# Altium project LiBattery-ChargeAndDischarge.PrjPcb
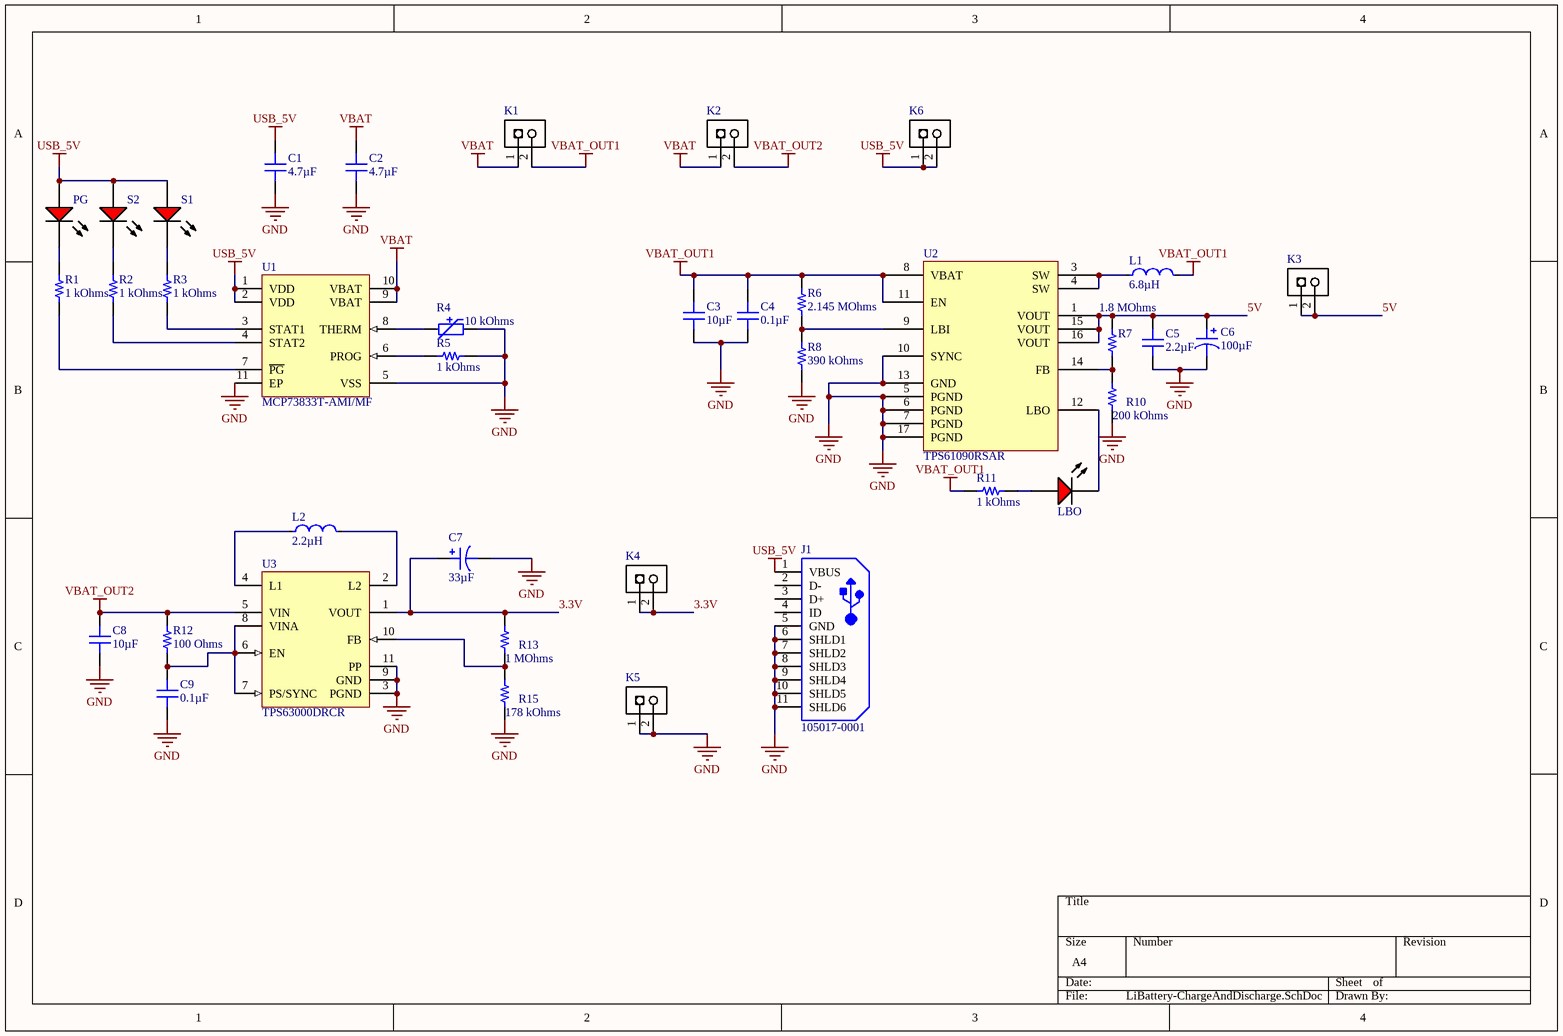
[diagram p0: LiBattery-ChargeAndDischarge.SchDoc]
1 sheet, 38 parts. Net scope: global (net labels, ports and power ports of the same name join across sheets).
Board file: LiBattery-ChargeAndDischarge.PcbDoc

## Sheet LiBattery-ChargeAndDischarge.SchDoc
size A4; SheetNumber: 1; SheetTotal: 1

### Parts
C1  4.7µF  [CAP 0603_1608]
C2  4.7µF  [CAP 0603_1608]
C3  10µF  [CAP 0603_1608]
C4  0.1µF  [CAP 0603_1608]
C5  2.2µF  [CAP 0603_1608]
C6  100µF  [CAP POL 1411_3528]
C7  33µF  [CAP POL 1411_3528]
C8  10µF  [CAP 0603_1608]
C9  0.1µF  [CAP 0603_1608]
J1  105017-0001  [USB-MICRO-B_V]
K1  HEADER-1X2  [HEADER-1X2]  (value not drawn)
K2  HEADER-1X2  [HEADER-1X2]  (value not drawn)
K3  HEADER-1X2  [HEADER-1X2]  (value not drawn)
K4  HEADER-1X2  [HEADER-1X2]  (value not drawn)
K5  HEADER-1X2  [HEADER-1X2]  (value not drawn)
K6  HEADER-1X2  [HEADER-1X2]  (value not drawn)
L1  6.8µH  [FP-IHLP-2525CZ-FP_2_413x3-MFG]
L2  2.2µH  [FP-IHLP-2525CZ-FP_2_413x3-MFG]
LBO  TLMS1100-GS08  [VISH-TLMX1100_V]  (value not drawn)
PG  TLMS1100-GS08  [VISH-TLMX1100_V]  (value not drawn)
R1  1 kOhms  [RES 0603_1608]
R2  1 kOhms  [RES 0603_1608]
R3  1 kOhms  [RES 0603_1608]
R4  10 kOhms  [PTC 0603_1608]
R5  1 kOhms  [RES 0603_1608]
R6  2.145 MOhms  [RES 0603_1608]
R7  1.8 MOhms  [RES 0603_1608]
R8  390 kOhms  [RES 0603_1608]
R10  200 kOhms  [RES 0603_1608]
R11  1 kOhms  [RES 0603_1608]
R12  100 Ohms  [RES 0603_1608]
R13  1 MOhms  [RES 0603_1608]
R15  178 kOhms  [RES 0603_1608]
S1  TLMS1100-GS08  [VISH-TLMX1100_V]  (value not drawn)
S2  TLMS1100-GS08  [VISH-TLMX1100_V]  (value not drawn)
U1  MCP73833T-AMI/MF  [DFN-MF10]
U2  TPS61090RSAR  [TI VQFN-16 4X4MM RSA]
U3  TPS63000DRCR  [DRC0010J_V]

### Nets
GND: C1.1 C2.1 C3.1 C4.2 C5.1 C6.2 C7.2 C8.1 C9.2 J1.5(GND) J1.6(SHLD1) J1.7(SHLD2) J1.8(SHLD3) J1.9(SHLD4) J1.10(SHLD5) J1.11(SHLD6) K5.1 K5.2 R4.1 R5.1 R8.1 R10.2 R15.2 U1.5(VSS) U1.11(EP) U2.5(PGND) U2.6(PGND) U2.7(PGND) U2.10(SYNC) U2.13(GND) U2.17(PGND) U3.3(PGND) U3.9(GND) U3.11(PP)
USB_5V: C1.2 J1.1(VBUS) K6.1 K6.2 PG.1(A) S1.1(A) S2.1(A) U1.1(VDD) U1.2(VDD)
VBAT: C2.2 K1.1 K2.1 U1.9(VBAT) U1.10(VBAT)
VBAT_OUT1: C3.2 C4.1 K1.2 L1.2 R6.2 R11.2 U2.8(VBAT) U2.11(EN)
VBAT_OUT2: C8.2 K2.2 R12.1 U3.5(VIN)
3.3V: C7.1 K4.1 K4.2 R13.1 U3.1(VOUT)
5V: C5.2 C6.1 K3.1 K3.2 R7.1 U2.1(VOUT) U2.15(VOUT) U2.16(VOUT)
NetC9_1: C9.1 R12.2 U3.6(EN) U3.7(PS/SYNC) U3.8(VINA)
NetL1_1: L1.1 U2.3(SW) U2.4(SW)
NetL2_1: L2.1 U3.4(L1)
NetL2_2: L2.2 U3.2(L2)
NetLBO_1: LBO.1(A) R11.1
NetLBO_2: LBO.2(K) U2.12(LBO)
NetPG_2: PG.2(K) R1.2
NetR1_1: R1.1 U1.7(~{PG})
NetR2_1: R2.1 U1.4(STAT2)
NetR2_2: R2.2 S2.2(K)
NetR3_1: R3.1 U1.3(STAT1)
NetR3_2: R3.2 S1.2(K)
NetR4_2: R4.2 U1.8(THERM)
NetR5_2: R5.2 U1.6(PROG)
NetR6_1: R6.1 R8.2 U2.9(LBI)
NetR7_2: R7.2 R10.1 U2.14(FB)
NetR13_2: R13.2 R15.1 U3.10(FB)

Not connected (* = marked no-connect by the designer): J1 2(D-) 3(D+) 4(ID)

### Library data of the parts
C1 C2 = C0603C105K4RACAUTO: CAP CER 0603 1UF 16V X7R 10%; Manufacturer: KEMET; Capacitance: 1µF; Part Number: C0603C105K4RACAUTO; Value: 4.7µF; Applications: Automotive, Bypass, Decoupling; ComponentLink1Description: Datasheet; ComponentLink1URL: https://api.kemet.com/component-edge/download/datasheet/C0603C105K4RACAUTO.pdf; ComponentLink2Description: DigiKey Link; ComponentLink2URL: http://digikey.com/product-detail/en/kemet/C0603C105K4RACAUTO/399-17704-1-ND/8635855; Device Package: 0603 (1608 Metric); LastUpdated: 2020/9/2 1:03:36; Lifecycle Status: Active; Minimum Order: 1; Mounting Type: Surface Mount, MLCC; Operating Temperature: -55°C ~ 125°C; Package / Case: 0603 (1608 Metric); Packaging: TapeAndReel; PartId: 2179; Part Status: Active; Price: 0.02; Ratings: AEC-Q200; Series: SMD Auto X7R; Size / Dimension: 0.063" L x 0.031" W (1.60mm x 0.80mm); Supplier 1: DigiKey; Supplier Part Number 1: 399-17704-1-ND; Temperature Coefficient: X7R; Thickness (Max): 0.037" (0.95mm); Tolerance: ±10%; Voltage - Rated: 16V
C3 C8 = GRM188R60J106ME47D: CAP CER 10UF 6.3V X5R 0603; Manufacturer: Murata Electronics; Tolerance: ±20%; Part Number: GRM188R60J106ME47D; Value: 10µF; Applications: General Purpose; Capacitance: 10µF; ComponentLink1Description: Datasheet; ComponentLink1URL: https://www.murata.com/~/media/webrenewal/support/library/catalog/products/capacitor/mlcc/c02e.ashx?la=en-us; ComponentLink2Description: DigiKey Link; ComponentLink2URL: http://digikey.com/product-detail/en/murata-electronics/GRM188R60J106ME47D/490-3896-1-ND/965938; Device Package: 0603 (1608 Metric); LastUpdated: 2020/9/2 1:03:35; Lifecycle Status: Active; Minimum Order: 1; Mounting Type: Surface Mount, MLCC; Operating Temperature: -55°C ~ 85°C; Package / Case: 0603 (1608 Metric); Packaging: TapeAndReel; PartId: 2351; Part Status: Active; Price: 0.03; Series: GRM; Size / Dimension: 0.063" L x 0.031" W (1.60mm x 0.80mm); Supplier 1: DigiKey; Supplier Part Number 1: 490-3896-1-ND; Temperature Coefficient: X5R; Thickness (Max): 0.035" (0.90mm); Voltage - Rated: 6.3V
C4 = 100X14W104MV4T: CAP CER 0.1UF 10V X7R 0603; Manufacturer: Johanson Dielectrics Inc.; Tolerance: ±20%; Part Number: 100X14W104MV4T; Value: 0.1µF; Applications: Bypass, Decoupling; Capacitance: 0.1µF; ComponentLink1Description: Datasheet; ComponentLink1URL: https://www.johansondielectrics.com/downloads/x2y-filter-and-decoupling-capacitors.pdf; ComponentLink2Description: DigiKey Link; ComponentLink2URL: http://digikey.com/product-detail/en/johanson-dielectrics-inc/100X14W104MV4T/709-1101-1-ND/1655915; Device Package: 0603 (1608 Metric); Features: Low ESL (X2Y); LastUpdated: 2020/9/2 1:03:35; Lifecycle Status: Active; Minimum Order: 1; Mounting Type: Surface Mount, MLCC; Operating Temperature: -55°C ~ 125°C; Package / Case: 0603 (1608 Metric); Packaging: TapeAndReel; PartId: 2680; Part Status: Active; Price: 0.11; Series: X2Y®; Size / Dimension: 0.064" L x 0.035" W (1.63mm x 0.89mm); Supplier 1: DigiKey; Supplier Part Number 1: 709-1101-1-ND; Temperature Coefficient: X7R; Thickness (Max): 0.026" (0.66mm); Voltage - Rated: 10V
C5 = CC0603ZRY5V7BB225: CAP CER 2.2UF 16V Y5V 0603; Manufacturer: Yageo; Temperature Coefficient: Y5V (F); Tolerance: -20%, +80%; Part Number: CC0603ZRY5V7BB225; Value: 2.2µF; Applications: General Purpose; Capacitance: 2.2µF; ComponentLink1Description: Datasheet; ComponentLink1URL: http://www.yageo.com/documents/recent/UPY-GPHC_Y5V_6.3V-to-50V_8.pdf; ComponentLink2Description: DigiKey Link; ComponentLink2URL: http://digikey.com/product-detail/en/yageo/CC0603ZRY5V7BB225/311-3416-1-ND/7164437; Device Package: 0603 (1608 Metric); LastUpdated: 2020/9/2 1:03:36; Lifecycle Status: Active; Minimum Order: 1; Mounting Type: Surface Mount, MLCC; Operating Temperature: -30°C ~ 85°C; Package / Case: 0603 (1608 Metric); Packaging: TapeAndReel; PartId: 2203; Part Status: Active; Price: 0.02; Series: CC; Size / Dimension: 0.063" L x 0.031" W (1.60mm x 0.80mm); Supplier 1: DigiKey; Supplier Part Number 1: 311-3416-1-ND; Thickness (Max): 0.035" (0.90mm); Voltage - Rated: 16V
C6 C7 = CWR11MH105KB: CAP TANT 1UF 10% 35V 1411; Manufacturer: KEMET; Manufacturer Size Code: B; Capacitance: 1µF; ESR (Equivalent Series Resistance): 6.5Ohm; Type: Molded; Part Number: CWR11MH105KB; ComponentLink1Description: Datasheet; ComponentLink1URL: https://api.kemet.com/component-edge/download/datasheet/CWR11MH105KB.pdf; ComponentLink2Description: DigiKey Link; ComponentLink2URL: http://digikey.com/product-detail/en/kemet/CWR11MH105KB/1001-2230-1-ND/3317720; Device Package: 1411 (3528 Metric); Failure Rate: B (0.1%); Features: High Reliability; Height - Seated (Max): 0.083" (2.10mm); LastUpdated: 2020/9/2 1:15:46; Lifecycle Status: Active; Minimum Order: 1; Mounting Type: Surface Mount; Operating Temperature: -55°C ~ 125°C; Package / Case: 1411 (3528 Metric); Packaging: TapeAndReel; PartId: 1; Part Status: Active; Price: 1.20; Series: Military, MIL-PRF-55365/8, CWR11; Size / Dimension: 0.138" L x 0.110" W (3.50mm x 2.80mm); Supplier 1: DigiKey; Supplier Part Number 1: 1001-2230-1-ND; Tolerance: ±10%; Voltage - Rated: 35V
  C6: Value: 100µF
  C7: Value: 33µF
C9 = GRM188R60J106ME47D: CAP CER 10UF 6.3V X5R 0603; Manufacturer: Murata Electronics; Capacitance: 10µF; Tolerance: ±20%; Part Number: GRM188R60J106ME47D; Value: 0.1µF; Applications: General Purpose; ComponentLink1Description: Datasheet; ComponentLink1URL: https://www.murata.com/~/media/webrenewal/support/library/catalog/products/capacitor/mlcc/c02e.ashx?la=en-us; ComponentLink2Description: DigiKey Link; ComponentLink2URL: http://digikey.com/product-detail/en/murata-electronics/GRM188R60J106ME47D/490-3896-1-ND/965938; Device Package: 0603 (1608 Metric); LastUpdated: 2020/9/2 1:03:35; Lifecycle Status: Active; Minimum Order: 1; Mounting Type: Surface Mount, MLCC; Operating Temperature: -55°C ~ 85°C; Package / Case: 0603 (1608 Metric); Packaging: TapeAndReel; PartId: 2351; Part Status: Active; Price: 0.03; Series: GRM; Size / Dimension: 0.063" L x 0.031" W (1.60mm x 0.80mm); Supplier 1: DigiKey; Supplier Part Number 1: 490-3896-1-ND; Temperature Coefficient: X5R; Thickness (Max): 0.035" (0.90mm); Voltage - Rated: 6.3V
J1 = CMP-2000-05827-1: Micro-USB B Receptacle, Right Angle, Bottom Mount, Surface Mount, with Solder Tabs, -30 to 85 degC, 5-Pin USB, RoHS, Tape and Reel; Manufacturer: Molex; Featured Product: Micro-USBConnectorsUSBConnectors; Other Names: WM1399DKR; Package Version: Rev. F, 12/2012; Number of Contacts: 5; Connector Type: USB-microB; Catalog Drawings: 1050170001; 3D Model: 105017-0001.stp; Mating Products: WM17145-ND-CABLEMICROUSBBTOSTDA1.0MWM17147-ND-CABLEMICROUSBBTOSTDA2.0MWM17146-ND-CABLEMICROUSBBTOSTDA1.5M; PCN Assembly/Origin: ResinSupplier21/Oct/2015; Voltage - Max: 30V; Online Catalog: Molex-MicroUSB; Manufacturer URL: http://www.molex.com/; Package Description: 5-Leads USB, Micro B, Body 7.5 x 5 mm, Pitch 0.65 mm; Datasheet URL: http://www.molex.com/elqNow/elqRedir.htm?ref=http://www.molex.com/webdocs/datasheets/pdf/en-us/1050170001_IO_CONNECTORS.pdf; Ingress Protection: -; Datasheet Version: 03/2016; Mounting Type: BoardCutout,SurfaceMount,RightAngle; Circuits: 5; Standard Package: 1; Package Reference: MICRO-B; Package URL: http://www.molex.com/pdm_docs/sd/1050170001_sd.pdf; Category: Connectors,Interconnects; Series: -; RoHS Information: 1050170001CertofCompliance; Features: Shielded,SolderRetention; Family: USB,DVI,HDMIConnectors; Specifications: -; Gender: Receptacle; Packaging: Digi-Reel®; Mounting Technology: SurfaceMount
K1-K6 = HEADER-1X2: REEL: TH; Supplier 1: Digi-Key; Supplier Part Number 1: S1011E-36-ND
L1 L2 = CMP-02424-000104-1: Commercial Inductors, High Saturation Series 6.8uH 4.5A 60mΩ 20%; Saturation Current: 8A; Self Resonant Frequency: 5MHz; Core Material: Metal; DC Resistance (DCR): 60mR; Test Frequency: 100kHz; Shielding: Shielded; Number of Pins: 2; Tolerance: 20%; Max DC Current: 8A; Max Operating Temperature: 125°C; Radiation Hardening: No; Inductance: 6.8uH; Contact Plating: Tin; RMS Current (Irms): 4.5A; Case/Package: 2525; Inductance Tolerance: 20%; Case Code (Metric): 6363; Lead Free: Lead Free; Package Quantity: 2000; Current Rating: 4.5A; Case Code (Imperial): 2525; Height - Seated (Max): 0.118inch; Height: 3mm; Mount: Surface Mount; Depth: 6.72mm; Military Standard: Not; Packaging: Tape and Reel; Min Operating Temperature: -55°C; Width: 0.255inch; Length: 7.24mm; Termination: SMD/SMT
LBO PG S1 S2 = CMP-1666-00027-1: LED, RED, 2.1 V, -40 to 100 degC, 2-Pin SMD (0603), RoHS, Tape and Reel; Type (Capacitors): C0G; Resistance: 100000000000 Ohm; Capacitance: 12 pF; Voltage Rating: 50 V; Tolerance: 5%; Min Operating Temperature: -55degC; REACH SVHC: No SVHC; ComponentLink2Description: Datasheet; ComponentLink1URL: http://www.vishay.com/; Width: 0.8 mm; Package Quantity: 4000; PackageReference: TLMX1100; ComponentLink2URL: http://www.vishay.com/docs/83173/tlmb1100.pdf; Case/Package: 0603; Case Code (Metric): 1608; Packaging: Tape and Reel; Pins: 2; ComponentLink1Description: Manufacturer URL; Max Operating Temperature: 125degC; Height: 0.8 mm; Length: 1.6 mm; Mount: Surface Mount; PackageDescription: 2-Pin Surface Mount Device, Body 1.6 x 0.8 mm; DatasheetVersion: Rev. 2.7, 03/2016; Case Code (Imperial): 0603; Voltage Rating (DC): 50 V; RoHSCompliant: True; Radiation Hardening: No
R1-R3 R7 R10-R13 R15 = RNCS0603BKE10K0: RES 10K OHM 0.1% 1/16W 0603; Manufacturer: Stackpole Electronics Inc; Power (Watts): 0.063W, 1/16W; Resistance: 10 kOhms; Temperature Coefficient: ±25ppm/°C; Part Number: RNCS0603BKE10K0; ComponentLink1Description: Datasheet; ComponentLink1URL: https://www.seielect.com/catalog/sei-rncs_rnch.pdf; ComponentLink2Description: DigiKey Link; ComponentLink2URL: http://digikey.com/product-detail/en/stackpole-electronics-inc/RNCS0603BKE10K0/RNCS0603BKE10K0CT-ND/1800113; Composition: Thin Film; Device Package: 0603 (1608 Metric); Features: Anti-Corrosive, Automotive AEC-Q200, Moisture Resistant; Height - Seated (Max): 0.022" (0.55mm); LastUpdated: 2020/9/2 1:10:25; Lifecycle Status: Active; Minimum Order: 1; Number of Terminations: 2; Operating Temperature: -55°C ~ 155°C; Package / Case: 0603 (1608 Metric); Packaging: TapeAndReel; PartId: 4838; Part Status: Active; Price: 0.08; Ratings: AEC-Q200; Series: RNCS; Size / Dimension: 0.061" L x 0.031" W (1.55mm x 0.80mm); Supplier 1: DigiKey; Supplier Part Number 1: RNCS0603BKE10K0CT-ND; Supplier Device Package: 0603; Tolerance: ±0.1%
  R1-R3 R11: Value: 1 kOhms
  R7: Value: 1.8 MOhms
  R10: Value: 200 kOhms
  R12: Value: 100 Ohms
  R13: Value: 1 MOhms
  R15: Value: 178 kOhms
R4 = B59641A0145A062: THERMISTOR PTC 470 OHM 50% 0603; Manufacturer: TDK Electronics Inc.; Resistance @ 25°C: 470 Ohms; Value: 470 Ohms; Part Number: B59641A0145A062; ComponentLink1Description: Datasheet; ComponentLink1URL: https://www.tdk-electronics.tdk.com/inf/55/db/PTC/PTC_Sensors_SMD_chips_superior.pdf; ComponentLink2Description: DigiKey Link; ComponentLink2URL: http://digikey.com/product-detail/en/tdk-electronics-inc/B59641A0145A062/495-4309-1-ND/2273341; Device Package: 0603 (1608 Metric); LastUpdated: 2020/9/2 1:30:58; Lifecycle Status: Active; Minimum Order: 1; Mounting Type: Surface Mount; Operating Temperature: -40°C ~ 125°C; Package / Case: 0603 (1608 Metric); Packaging: TapeAndReel; Part Status: Active; Price: 0.18; Resistance Tolerance: ±50%; Series: Automotive, AEC-Q200, B59641; Supplier 1: DigiKey; Supplier Part Number 1: 495-4309-1-ND; Supplier Device Package: 0603
R5 = RNCS0603BKE10K0: RES 10K OHM 0.1% 1/16W 0603; Manufacturer: Stackpole Electronics Inc; Power (Watts): 0.063W, 1/16W; Temperature Coefficient: ±25ppm/°C; Part Number: RNCS0603BKE10K0; Value: 1 kOhms; ComponentLink1Description: Datasheet; ComponentLink1URL: https://www.seielect.com/catalog/sei-rncs_rnch.pdf; ComponentLink2Description: DigiKey Link; ComponentLink2URL: http://digikey.com/product-detail/en/stackpole-electronics-inc/RNCS0603BKE10K0/RNCS0603BKE10K0CT-ND/1800113; Composition: Thin Film; Device Package: 0603 (1608 Metric); Features: Anti-Corrosive, Automotive AEC-Q200, Moisture Resistant; Height - Seated (Max): 0.022" (0.55mm); LastUpdated: 2020/9/2 1:10:25; Lifecycle Status: Active; Minimum Order: 1; Number of Terminations: 2; Operating Temperature: -55°C ~ 155°C; Package / Case: 0603 (1608 Metric); Packaging: TapeAndReel; PartId: 4838; Part Status: Active; Price: 0.08; Ratings: AEC-Q200; Resistance: 1 kOhms; Series: RNCS; Size / Dimension: 0.061" L x 0.031" W (1.55mm x 0.80mm); Supplier 1: DigiKey; Supplier Part Number 1: RNCS0603BKE10K0CT-ND; Supplier Device Package: 0603; Tolerance: ±0.1%
R6 = RMCF0603FT2M32: RES 2.32M OHM 1% 1/10W 0603; Manufacturer: Stackpole Electronics Inc; Power (Watts): 0.1W, 1/10W; Resistance: 2.32 MOhms; Temperature Coefficient: ±200ppm/°C; Part Number: RMCF0603FT2M32; Value: 2.145 MOhms; ComponentLink1Description: Datasheet; ComponentLink1URL: https://www.seielect.com/catalog/sei-rmcf_rmcp.pdf; ComponentLink2Description: DigiKey Link; ComponentLink2URL: http://digikey.com/product-detail/en/stackpole-electronics-inc/RMCF0603FT2M32/RMCF0603FT2M32CT-ND/7790161; Composition: Thick Film; Device Package: 0603 (1608 Metric); Features: Automotive AEC-Q200; Height - Seated (Max): 0.022" (0.55mm); LastUpdated: 2020/9/2 1:10:24; Lifecycle Status: Active; Minimum Order: 1; Number of Terminations: 2; Operating Temperature: -55°C ~ 155°C; Package / Case: 0603 (1608 Metric); Packaging: CutTape; PartId: 5184; Part Status: Active; Price: 0.10; Ratings: AEC-Q200; Series: RMCF; Size / Dimension: 0.061" L x 0.031" W (1.55mm x 0.80mm); Supplier 1: DigiKey; Supplier Part Number 1: RMCF0603FT2M32CT-ND; Supplier Device Package: 0603; Tolerance: ±1%
R8 = CRGP0603F390K: CRGP 0603 390K 1%; Manufacturer: TE Connectivity Passive Product; Power (Watts): 0.25W, 1/4W; Temperature Coefficient: ±100ppm/°C; Part Number: CRGP0603F390K; Value: 390 kOhms; ComponentLink1Description: Datasheet; ComponentLink1URL: https://www.te.com/commerce/DocumentDelivery/DDEController?Action=srchrtrv&DocNm=9-1773463-9&DocType=DS&DocLang=English; ComponentLink2Description: DigiKey Link; ComponentLink2URL: http://digikey.com/product-detail/en/te-connectivity-passive-product/CRGP0603F390K/A130447CT-ND/8578279; Composition: Thick Film; Device Package: 0603 (1608 Metric); Features: Pulse Withstanding; Height - Seated (Max): 0.022" (0.55mm); LastUpdated: 2020/9/2 1:10:24; Lifecycle Status: Active; Minimum Order: 1; Number of Terminations: 2; Operating Temperature: -55°C ~ 155°C; Package / Case: 0603 (1608 Metric); Packaging: TapeAndReel; PartId: 5025; Part Status: Active; Price: 0.02; Resistance: 390 kOhms; Series: CRGP; Size / Dimension: 0.063" L x 0.031" W (1.60mm x 0.80mm); Supplier 1: DigiKey; Supplier Part Number 1: A130447CT-ND; Supplier Device Package: 0603; Tolerance: ±1%
U1 = CMP-0133-00083-1: Stand-Alone Linear Li-Ion/Li-Polymer Charge Management Controller with Power-Good Output, 4.2V, 10-Pin DFN, Industrial Temperature, Tape and Reel; PackageVersion: revBB, Aug-2009; PackageDescription: 10-Lead Plastic Dual Flat, No Lead Package (MF) - 3x3x0.9mm Body [DFN]; PackageReference: DFN-MF10; DatasheetVersion: revB, May-2009
U2 = TPS61090RSAR: IC REG BOOST ADJUSTABLE 2A 16QFN; Manufacturer: Texas Instruments; Current - Output: 2A (Switch); Frequency - Switching: 600kHz; Function: Step-Up; Number of Outputs: 1; Output Configuration: Positive; Synchronous Rectifier: Yes; Voltage - Input (Max): 5.5V; Voltage - Input (Min): 1.8V; Part Number: TPS61090RSAR; ComponentLink1Description: Datasheet; ComponentLink1URL: http://www.ti.com/general/docs/suppproductinfo.tsp?distId=10&gotoUrl=http%3A%2F%2Fwww.ti.com%2Flit%2Fgpn%2Ftps61090; ComponentLink2Description: DigiKey Link; ComponentLink2URL: //digikey.com/product-detail/en/texas-instruments/TPS61090RSAR/296-15259-2-ND/566911; Device Package: 16-VQFN Exposed Pad; LastUpdated: 2019/12/12 9:54:39; Lifecycle Status: 0; Minimum Order: 1; Mounting Type: Surface Mount; Operating Temperature: -40°C ~ 85°C (TA); Output Type: Adjustable; Package / Case: 16-VQFN Exposed Pad; Packaging: TapeAndReel; Part Status: Active; Price: 1.03; Series: -; Supplier 1: DigiKey; Supplier Part Number 1: 296-15259-2-ND; Supplier Device Package: 16-QFN (4x4); Topology: Boost; Voltage - Output (Max): 5.5V; Voltage - Output (Min/Fixed): 1.8V
U3 = CMP-0345-00001-2: Buck-Boost Voltage Converter with 1.8 to 5.5 V Input and 1.2 to 5.5 V Output, -40 to 85 degC, 10-Pin SON (DRC), Green (RoHS & no Sb/Br); Manufacturer: Texas Instruments; Vout(Max)(V): 5.5; Synchronous Rectification: TRUE; SubFamily: Buck-Boost Regulator; Vin(Min)(V): 1.8; Iq(Typ)(mA): 0.04; Iout(Max)(A): 1.2; Regulated Outputs(#): 1; Switching Frequency(Max)(kHz): 1500; ComponentLink1Description: Datasheet; Mounting Technology: Surface Mount; DatasheetVersion: SLVS520B; Eco-Plan: Green (RoHS & no Sb/Br); PackageVersion: revL, Sep-2011; PackageDescription: 10-Pin Plastic Small Outline No-Lead, 3 x 3 x 1 mm Body, 0.5 mm Pitch, Exposed Pad; Vout(Min)(V): 1.2; Vin(Max)(V): 5.5; Topology: Buck-Boost; Dynamic Voltage Scaling: TRUE; ComponentLink1URL: http://www.ti.com/general/docs/lit/getliterature.tsp?genericPartNumber=TPS63000&fileType=pdf; PartNumber: TPS63000DRCR; ComponentLink2URL: http://www.ti.com/litv/pdf/mpds117k; PackageReference: DRC0010J; ComponentLink2Description: Package Specification